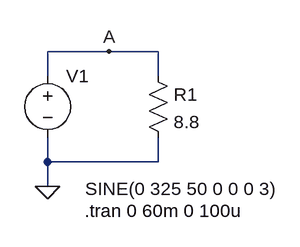
[diagram p0: schematic Lecture1_Ex4.asc]
Lecture1_Ex4.asc, the LTspice schematic file:
Version 4
SHEET 1 880 680
WIRE 128 80 48 80
WIRE 192 80 128 80
WIRE 48 112 48 80
WIRE 192 112 192 80
WIRE 48 224 48 192
WIRE 192 224 192 192
WIRE 192 224 48 224
WIRE 48 256 48 224
FLAG 48 256 0
FLAG 128 80 A
SYMBOL res 176 96 R0
SYMATTR InstName R1
SYMATTR Value 8.8
SYMBOL voltage 48 96 R0
WINDOW 3 49 163 Left 2
WINDOW 123 0 0 Left 0
WINDOW 39 0 0 Left 0
SYMATTR InstName V1
SYMATTR Value SINE(0 325 50 0 0 0 3)
TEXT 96 288 Left 2 !.tran 0 60m 0 100u

The netlist it stands for:
* Lecture1_Ex4.asc
R1 A 0 8.8
V1 A 0 SINE(0 325 50 0 0 0 3)
.tran 0 60m 0 100u
.backanno
.end